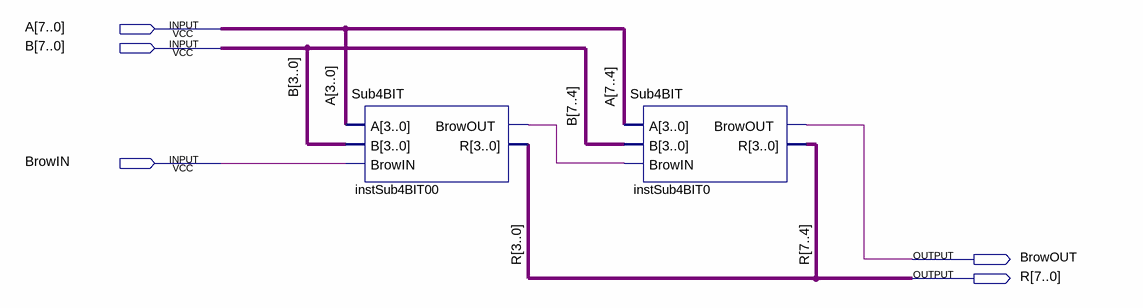
[diagram p0: schematic sheet]
// Quartus schematic Sub8BIT.bdf as structural Verilog: 2 symbols, 5 pins
module Sub8BIT (
  input  [7:0] A,
  input  [7:0] B,
  input  BrowIN,
  output BrowOUT,
  output [7:0] R
);

  wire instSub4BIT00_browout;

  Sub4BIT instSub4BIT00 (.A(A[3:0]), .B(B[3:0]), .BrowIN(BrowIN), .BrowOUT(instSub4BIT00_browout), .R(R[3:0]));
  Sub4BIT instSub4BIT0 (.A(A[7:4]), .B(B[7:4]), .BrowIN(instSub4BIT00_browout), .BrowOUT(BrowOUT), .R(R[7:4]));
endmodule
